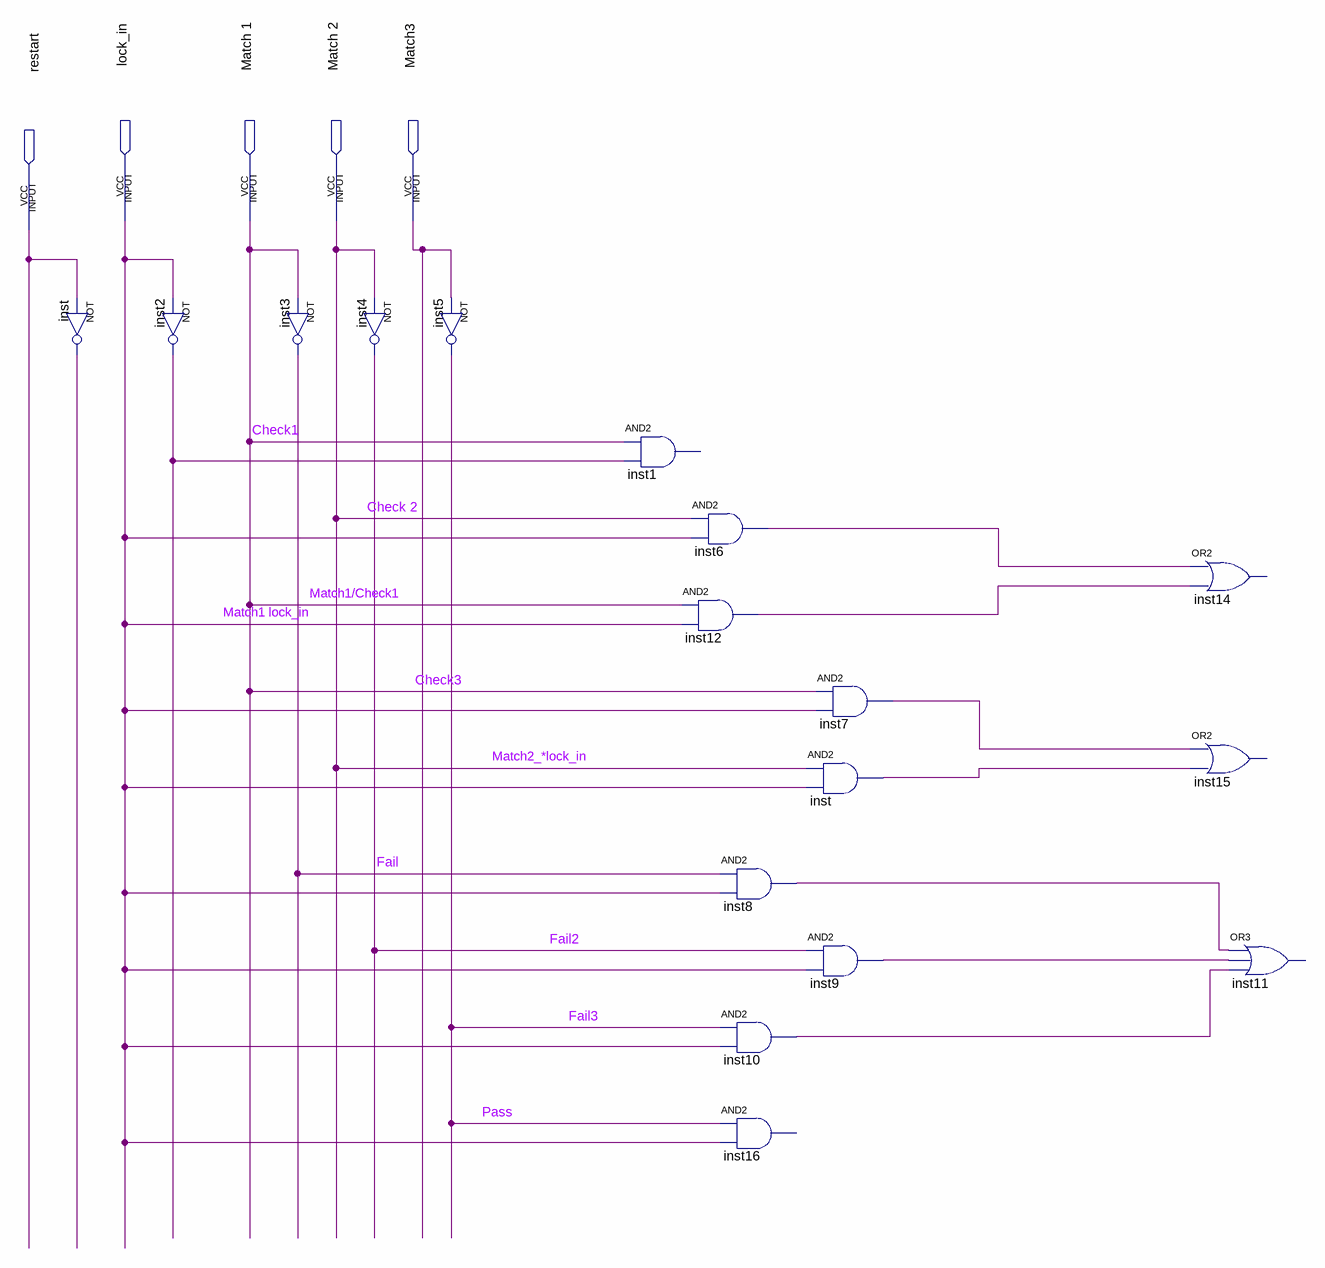
[diagram p0: schematic sheet]
// Quartus schematic Finite_State_Machine.bdf as structural Verilog: 17 symbols, 5 pins
module Finite_State_Machine (
  input  lock_in,
  input  \Match_1 ,
  input  \Match_2 ,
  input  Match3,
  input  restart
);

  wire Fail, Fail2, Fail3, inst2_out, inst6_out, inst7_out, inst8_out, inst9_out, inst10_out, inst12_out,
       inst_out, inst_out_2;

  not inst (inst_out, restart);
  not inst2 (inst2_out, lock_in);
  not inst3 (Fail, \Match_1 );
  not inst4 (Fail2, \Match_2 );
  not inst5 (Fail3, Match3);
  // AND2 inst1 has open pins: IN1=\Match_1 , IN2=inst2_out, OUT=open
  and inst6 (inst6_out, \Match_2 , lock_in);
  and inst12 (inst12_out, \Match_1 , lock_in);
  and inst8 (inst8_out, Fail, lock_in);
  and inst10 (inst10_out, Fail3, lock_in);
  // AND2 inst16 has open pins: IN1=Fail3, IN2=lock_in, OUT=open
  and inst7 (inst7_out, \Match_1 , lock_in);
  and inst_dup2 (inst_out_2, \Match_2 , lock_in);
  and inst9 (inst9_out, Fail2, lock_in);
  // OR2 inst14 has open pins: IN1=inst6_out, IN2=inst12_out, OUT=open
  // OR2 inst15 has open pins: IN1=inst7_out, IN2=inst_out_2, OUT=open
  // OR3 inst11 has open pins: IN1=inst8_out, IN2=inst9_out, IN3=inst10_out, OUT=open

  // Other names for the same wires on the sheet: Check 2 = \Match_2 ; Match2_*lock_in = \Match_2 ;
  //   Match1 lock_in = lock_in; Check1 = \Match_1 ; Check3 = \Match_1 ; Match1/Check1 = \Match_1 ; Pass = Fail3
endmodule
